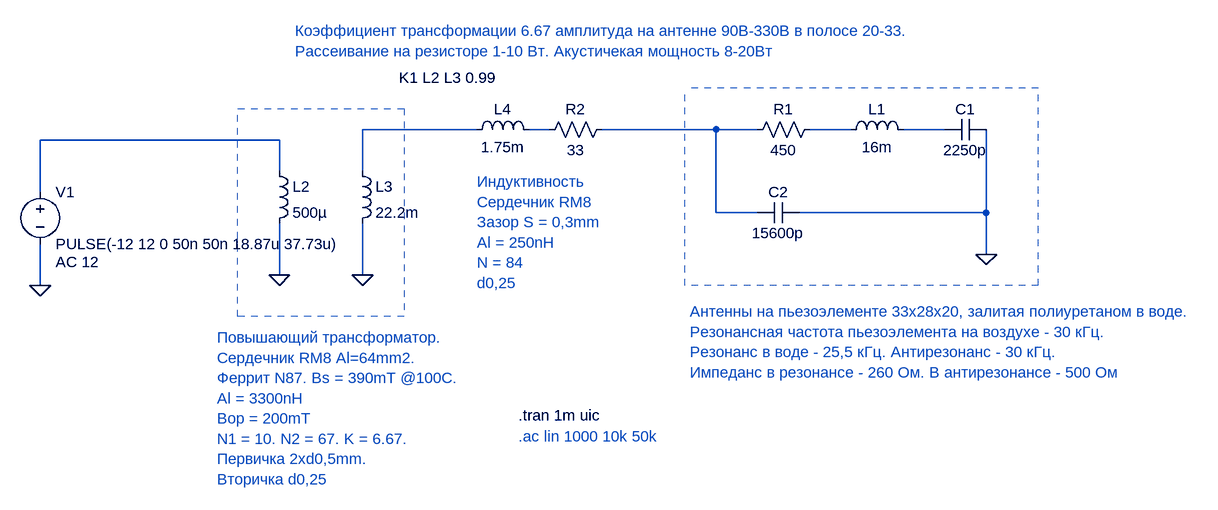
[diagram p0: schematic Power_amp_V2.asc]
Power_amp_V2.asc, the LTspice schematic file:
Version 4.1
SHEET 1 1104 680
WIRE -384 32 -560 32
WIRE -272 32 -304 32
WIRE -16 32 -192 32
WIRE 48 32 -16 32
WIRE 192 32 128 32
WIRE 336 32 272 32
WIRE -688 48 -1056 48
WIRE -688 96 -688 48
WIRE -560 96 -560 32
WIRE -1056 128 -1056 48
WIRE -16 160 -16 32
WIRE 48 160 -16 160
WIRE 400 160 400 32
WIRE 400 160 112 160
WIRE 400 224 400 160
WIRE -688 256 -688 176
WIRE -560 256 -560 176
WIRE -1056 272 -1056 208
FLAG 400 224 0
FLAG -1056 272 0
FLAG -688 256 0
FLAG -560 256 0
SYMBOL res 144 16 R90
WINDOW 0 0 56 VBottom 2
WINDOW 3 32 56 VTop 2
SYMATTR InstName R1
SYMATTR Value 450
SYMBOL ind 176 48 R270
WINDOW 0 32 56 VTop 2
WINDOW 3 5 56 VBottom 2
SYMATTR InstName L1
SYMATTR Value 16m
SYMATTR SpiceLine Rser=1m
SYMBOL cap 400 16 R90
WINDOW 0 0 32 VBottom 2
WINDOW 3 32 32 VTop 2
SYMATTR InstName C1
SYMATTR Value 2250p
SYMBOL cap 112 144 R90
WINDOW 0 0 32 VBottom 2
WINDOW 3 32 32 VTop 2
SYMATTR InstName C2
SYMATTR Value 15600p
SYMBOL voltage -1056 112 R0
WINDOW 123 24 124 Left 2
WINDOW 39 0 0 Left 0
SYMATTR Value2 AC 12
SYMATTR InstName V1
SYMATTR Value PULSE(-12 12 0 50n 50n 18.87u 37.73u)
SYMBOL ind -704 80 R0
SYMATTR InstName L2
SYMATTR Value 500µ
SYMATTR Type ind
SYMATTR SpiceLine Rser=1m
SYMBOL ind -576 80 R0
SYMATTR InstName L3
SYMATTR Value 22.2m
SYMATTR Type ind
SYMATTR SpiceLine Rser=0.5
SYMBOL ind -400 48 R270
WINDOW 0 32 56 VTop 2
WINDOW 3 5 56 VBottom 2
SYMATTR InstName L4
SYMATTR Value 1.75m
SYMATTR SpiceLine Rser=0.7
SYMBOL res -176 16 R90
WINDOW 0 0 56 VBottom 2
WINDOW 3 32 56 VTop 2
SYMATTR InstName R2
SYMATTR Value 33
TEXT -504 -48 Left 2 !K1 L2 L3 0.99
TEXT -320 472 Left 2 !.tran 1m uic
TEXT -320 504 Left 2 ;.ac lin 1000 10k 50k
TEXT -664 -120 Left 2 ;Коэффициент трансформации 6.67 амплитуда на антенне 90В-330В в полосе 20-33. \nРассеивание на резисторе 1-10 Вт. Акустичекая мощность 8-20Вт
TEXT -56 312 Left 2 ;Антенны на пьезоэлементе 33x28x20, залитая полиуретаном в воде.\nРезонансная частота пьезоэлемента на воздухе - 30 кГц.\nРезонанс в воде - 25,5 кГц. Антирезонанс - 30 кГц.\nИмпеданс в резонансе - 260 Ом. В антирезонансе - 500 Ом
TEXT -784 352 Left 2 ;Повышающий трансформатор. \nСердечник RM8 Al=64mm2.\nФеррит N87. Bs = 390mT @100C.\nAl = 3300nH\nBop = 200mT\nN1 = 10. N2 = 67. K = 6.67.\nПервичка 2xd0,5mm.\nВторичка d0,25
TEXT -384 112 Left 2 ;Индуктивность\nСердечник RM8\nЗазор S = 0,3mm\nAl = 250nH\nN = 84\nd0,25
LINE Normal -64 272 -64 -32 2
LINE Normal 480 272 -64 272 2
LINE Normal 480 -32 -64 -32 2
LINE Normal 480 272 480 -32 2
LINE Normal -752 320 -752 0 2
LINE Normal -496 320 -752 320 2
LINE Normal -496 0 -496 320 2
LINE Normal -752 0 -496 0 2

The netlist it stands for:
* Power_amp_V2.asc
R1 N004 N003 450
L1 N004 N005 16m Rser=1m
C1 0 N005 2250p
C2 0 N003 15600p
V1 N006 0 PULSE(-12 12 0 50n 50n 18.87u 37.73u) AC 12
L2 N006 0 500µ Rser=1m
L3 N001 0 22.2m Rser=0.5
L4 N001 N002 1.75m Rser=0.7
R2 N003 N002 33
K1 L2 L3 0.99
.tran 1m uic
* .ac lin 1000 10k 50k
* Коэффициент трансформации 6.67 амплитуда на антенне 90В-330В в полосе 20-33.
* Рассеивание на резисторе 1-10 Вт. Акустичекая мощность 8-20Вт
* Антенны на пьезоэлементе 33x28x20, залитая полиуретаном в воде.
* Резонансная частота пьезоэлемента на воздухе - 30 кГц.
* Резонанс в воде - 25,5 кГц. Антирезонанс - 30 кГц.
* Импеданс в резонансе - 260 Ом. В антирезонансе - 500 Ом
* Повышающий трансформатор.
* Сердечник RM8 Al=64mm2.
* Феррит N87. Bs = 390mT @100C.
* Al = 3300nH
* Bop = 200mT
* N1 = 10. N2 = 67. K = 6.67.
* Первичка 2xd0,5mm.
* Вторичка d0,25
* Индуктивность
* Сердечник RM8
* Зазор S = 0,3mm
* Al = 250nH
* N = 84
* d0,25
.backanno
.end